# EAGLE board scooter (EAGLE 4.11), part 1 of 2
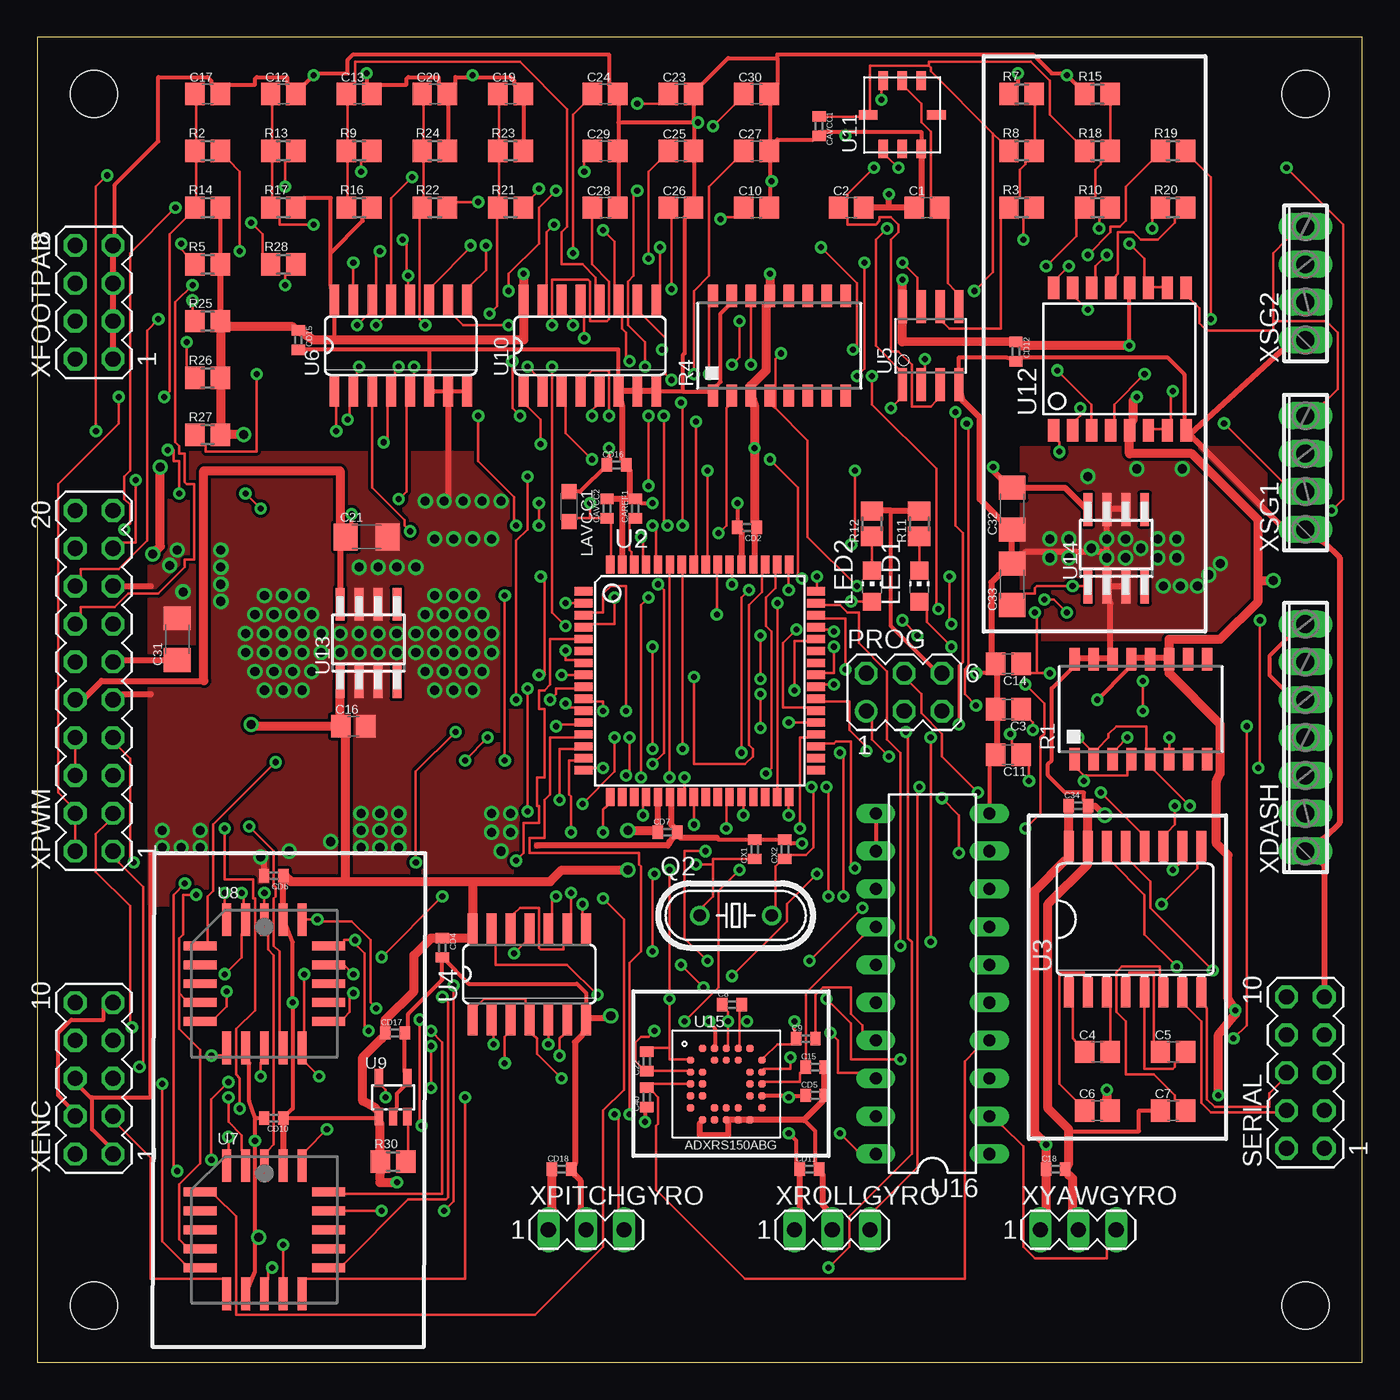
[diagram p5: board, top side]
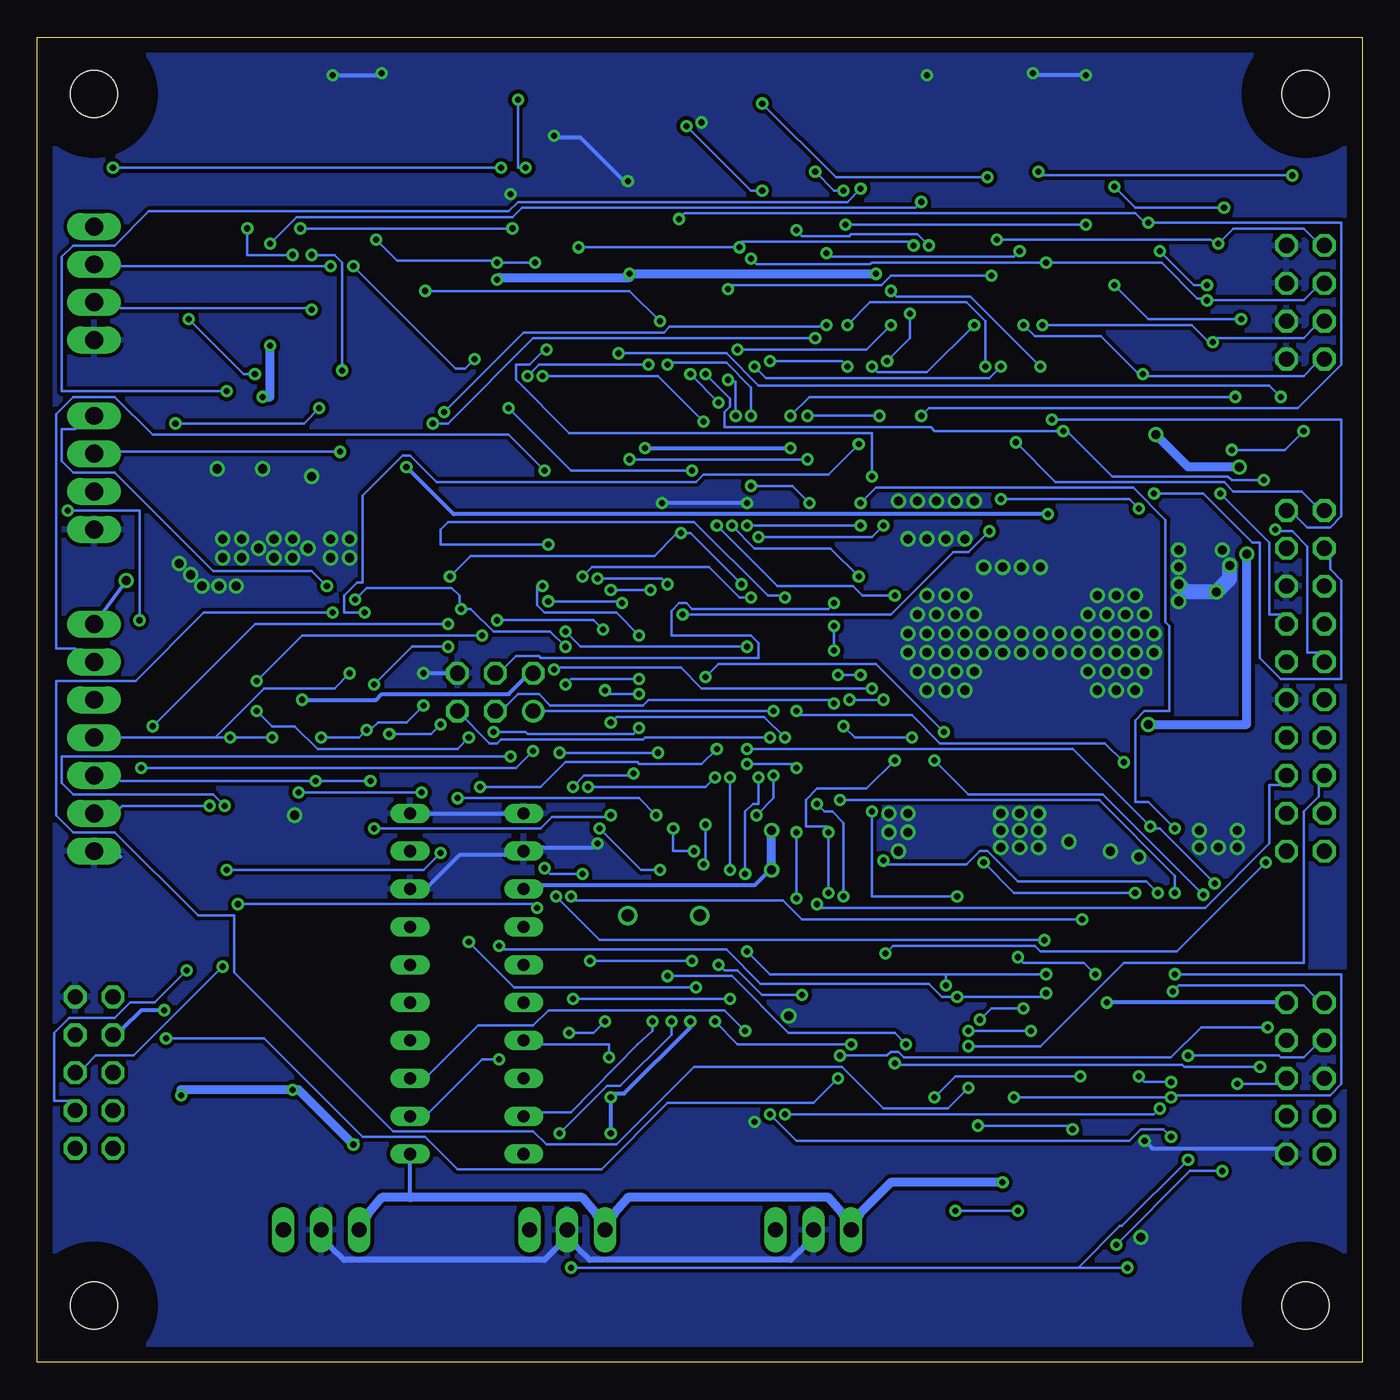
[diagram p6: board, bottom side, seen from below]

Size 88.9 x 88.9 mm. Coordinates in mm from the lower left corner, seen from the top.
Outline: 0,0 88.9,0 88.9,88.9 0,88.9 0,0
Copper layers (1*16): Top 0.035mm / dielectric 1.5mm / Bottom 0.035mm
Design rules "default": minimum track width 7mil, minimum drill 16mil, track to track 8mil, track to pad 8mil, pad to pad 8mil, via to via 8mil, smd to smd 8mil, copper to edge 40mil, drill to drill 8mil, minimum pad ring 10mil, minimum via ring 8mil, stop-mask expansion 4mil, vias tented up to drill 0mil, thermal gap 10mil
Net classes: 1 pwr: width 0.254 mm; 2 bigpwr: width 0.914 mm, clearance 0.813 mm; 3 ugpwr: width 0.61 mm, clearance 0.61 mm
Holes 3.17 mm at 3.81,85.09 85.09,3.81 3.81,3.81 85.09,85.09
tRestrict: area 0,81.3 to 7.6,88.9; area 81.3,81.3 to 88.9,88.9; area 81.3,0 to 88.9,7.6; area 0,0 to 7.6,7.6
bRestrict: area 0,81.3 to 7.6,88.9; area 81.3,81.3 to 88.9,88.9; area 81.3,0 to 88.9,7.6; area 0,0 to 7.6,7.6

## Footprints (pad centres in the part's own frame; a part is rotated, then mirrored left to right if it is on the bottom)
C0805 = smd 1.3 x 1.5: 1 -0.85,0; 2 0.85,0
C0402 = smd 0.7 x 0.9: 1 -0.65,0; 2 0.65,0
C1206 = smd 1.6 x 1.8: 1 -1.4,0; 2 1.4,0
L2012C = smd 1 x 1: 1 -1,0; 2 1,0
CHIP-LED0805 = smd 1.2 x 1.2: A 0,-1.05; C 0,1.05
MA03-2 = drill 1.016 round: 1 -2.54,-1.27 | drill 1.016 octagon: 2 -2.54,1.27; 3 0,-1.27; 4 0,1.27; 5 2.54,-1.27; 6 2.54,1.27
HC49/S = drill 0.813 round: 1 -2.413,0; 2 2.413,0
4816P = smd 0.7 x 1.5: 1 -4.445,-3.346; 2 -3.175,-3.346; 3 -1.905,-3.346; 4 -0.635,-3.346; 5 0.635,-3.346; 6 1.905,-3.346; 7 3.175,-3.346; 8 4.445,-3.346; 9 4.445,3.346; 10 3.175,3.346; 11 1.905,3.346; 12 0.635,3.346; 13 -0.635,3.346; 14 -1.905,3.346; 15 -3.175,3.346; 16 -4.445,3.346
R0805 = smd 1.3 x 1.5: 1 -0.85,0; 2 0.85,0
MA05-2 = drill 1.016 octagon: 1 -5.08,-1.27; 2 -5.08,1.27; 3 -2.54,-1.27; 4 -2.54,1.27; 5 0,-1.27; 6 0,1.27; 7 2.54,-1.27; 8 2.54,1.27; 9 5.08,-1.27; 10 5.08,1.27
TQFP64 = smd 1.194 x 0.559: 1 -7.8,6; 2 -7.8,5.2; 3 -7.8,4.4; 4 -7.8,3.6; 5 -7.8,2.8; 6 -7.8,2; 7 -7.8,1.2; 8 -7.8,0.4; 9 -7.8,-0.4; 10 -7.8,-1.2; 11 -7.8,-2; 12 -7.8,-2.8; 13 -7.8,-3.6; 14 -7.8,-4.4; 15 -7.8,-5.2; 16 -7.8,-6; 33 7.8,-6; 34 7.8,-5.2; 35 7.8,-4.4; 36 7.8,-3.6; 37 7.8,-2.8; 38 7.8,-2; 39 7.8,-1.2; 40 7.8,-0.4; 41 7.8,0.4; 42 7.8,1.2; 43 7.8,2; 44 7.8,2.8; 45 7.8,3.6; 46 7.8,4.4; 47 7.8,5.2; 48 7.8,6 | smd 0.559 x 1.194: 17 -6,-7.8; 18 -5.2,-7.8; 19 -4.4,-7.8; 20 -3.6,-7.8; 21 -2.8,-7.8; 22 -2,-7.8; 23 -1.2,-7.8; 24 -0.4,-7.8; 25 0.4,-7.8; 26 1.2,-7.8; 27 2,-7.8; 28 2.8,-7.8; 29 3.6,-7.8; 30 4.4,-7.8; 31 5.2,-7.8; 32 6,-7.8; 49 6,7.8; 50 5.2,7.8; 51 4.4,7.8; 52 3.6,7.8; 53 2.8,7.8; 54 2,7.8; 55 1.2,7.8; 56 0.4,7.8; 57 -0.4,7.8; 58 -1.2,7.8; 59 -2,7.8; 60 -2.8,7.8; 61 -3.6,7.8; 62 -4.4,7.8; 63 -5.2,7.8; 64 -6,7.8
SO16L = smd 0.66 x 2.032: 1 -4.445,-4.902; 2 -3.175,-4.902; 3 -1.905,-4.902; 4 -0.635,-4.902; 5 0.635,-4.902; 6 1.905,-4.902; 7 3.175,-4.902; 8 4.445,-4.902; 9 4.445,4.902; 10 3.175,4.902; 11 1.905,4.902; 12 0.635,4.902; 13 -0.635,4.902; 14 -1.905,4.902; 15 -3.175,4.902; 16 -4.445,4.902
SO14 = smd 0.66 x 2.032: 1 -3.81,-3.073; 2 -2.54,-3.073; 3 -1.27,-3.073; 4 0,-3.073; 5 1.27,-3.073; 6 2.54,-3.073; 7 3.81,-3.073; 8 3.81,3.073; 9 2.54,3.073; 10 1.27,3.073; 11 0,3.073; 12 -1.27,3.073; 13 -2.54,3.073; 14 -3.81,3.073
SO08 = smd 0.61 x 2.21: 1 -1.905,-2.616; 2 -0.635,-2.616; 3 0.635,-2.616; 4 1.905,-2.616; 5 1.905,2.616; 6 0.635,2.616; 7 -0.635,2.616; 8 -1.905,2.616
SO16 = smd 0.66 x 2.032: 1 -4.445,-3.073; 2 -3.175,-3.073; 3 -1.905,-3.073; 4 -0.635,-3.073; 5 0.635,-3.073; 6 1.905,-3.073; 7 3.175,-3.073; 8 4.445,-3.073; 9 4.445,3.073; 10 3.175,3.073; 11 1.905,3.073; 12 0.635,3.073; 13 -0.635,3.073; 14 -1.905,3.073; 15 -3.175,3.073; 16 -4.445,3.073
PLCC20 = smd 0.6 x 2.2: 1 0,4.3; 2 -1.27,4.3; 3 -2.54,4.3; 9 -2.54,-4.3; 10 -1.27,-4.3; 11 0,-4.3; 12 1.27,-4.3; 13 2.54,-4.3; 19 2.54,4.3; 20 1.27,4.3 | smd 2.2 x 0.6: 4 -4.3,2.54; 5 -4.3,1.27; 6 -4.3,0; 7 -4.3,-1.27; 8 -4.3,-2.54; 14 4.3,-2.54; 15 4.3,-1.27; 16 4.3,0; 17 4.3,1.27; 18 4.3,2.54
SOT23-5L = smd 0.55 x 1.2: 1 -0.95,-1.3; 2 0,-1.3; 3 0.95,-1.3; 4 0.95,1.3; 5 -0.95,1.3
E-8 = smd 1.27 x 0.635: 1 -2.286,1.27; 2 -2.286,0; 3 -2.286,-1.27; 5 2.286,-1.27; 6 2.286,0; 7 2.286,1.27 | smd 0.635 x 1.27: 4 0,-2.286; 8 0,2.286
SO16-1 = smd 0.762 x 1.524: 1 -4.445,-4.775; 2 -3.175,-4.775; 3 -1.905,-4.775; 4 -0.635,-4.775; 5 0.635,-4.775; 6 1.905,-4.775; 7 3.175,-4.775; 8 4.445,-4.775; 9 4.445,4.775; 10 3.175,4.775; 11 1.905,4.775; 12 0.635,4.775; 13 -0.635,4.775; 14 -1.905,4.775; 15 -3.175,4.775; 16 -4.445,4.775
SO08' = smd 0.6 x 2.2: 1 -1.905,-2.6; 2 -0.635,-2.6; 3 0.635,-2.6; 4 1.905,-2.6; 5 1.905,2.6; 6 0.635,2.6; 7 -0.635,2.6; 8 -1.905,2.6
BC-32 = smd 0.5 x 0.5: A2 -1.6,2.4; A3 -0.8,2.4; A4 0,2.4; A5 0.8,2.4; A6 1.6,2.4; B1 -2.4,1.6; B3 -0.8,1.6; B4 0,1.6; B5 0.8,1.6; B7 2.4,1.6; C1 -2.4,0.8; C2 -1.6,0.8; C6 1.6,0.8; C7 2.4,0.8; D1 -2.4,0; D2 -1.6,0; D6 1.6,0; D7 2.4,0; E1 -2.4,-0.8; E2 -1.6,-0.8; E6 1.6,-0.8; E7 2.4,-0.8; F1 -2.4,-1.6; F3 -0.8,-1.6; F4 0,-1.6; F5 0.8,-1.6; F7 2.4,-1.6; G2 -1.6,-2.4; G3 -0.8,-2.4; G4 0,-2.4; G5 0.8,-2.4; G6 1.6,-2.4
DIL20 = drill 0.813 long: 1 -11.43,-3.81; 2 -8.89,-3.81; 3 -6.35,-3.81; 4 -3.81,-3.81; 5 -1.27,-3.81; 6 1.27,-3.81; 7 3.81,-3.81; 8 6.35,-3.81; 9 8.89,-3.81; 10 11.43,-3.81; 11 11.43,3.81; 12 8.89,3.81; 13 6.35,3.81; 14 3.81,3.81; 15 1.27,3.81; 16 -1.27,3.81; 17 -3.81,3.81; 18 -6.35,3.81; 19 -8.89,3.81; 20 -11.43,3.81
7POL254 = drill 1.2 long: 1 -7.62,0; 2 -5.08,0; 3 -2.54,0; 4 0,0; 5 2.54,0; 6 5.08,0; 7 7.62,0
MA04-2 = drill 1.016 octagon: 1 -3.81,-1.27; 2 -3.81,1.27; 3 -1.27,-1.27; 4 -1.27,1.27; 5 1.27,-1.27; 6 1.27,1.27; 7 3.81,-1.27; 8 3.81,1.27
MA03-1 = drill 1.016 long: 1 -2.54,0; 2 0,0; 3 2.54,0
MA10-2 = drill 1.016 octagon: 1 -11.43,-1.27; 2 -11.43,1.27; 3 -8.89,-1.27; 4 -8.89,1.27; 5 -6.35,-1.27; 6 -6.35,1.27; 7 -3.81,-1.27; 8 -3.81,1.27; 9 -1.27,-1.27; 10 -1.27,1.27; 11 1.27,-1.27; 12 1.27,1.27; 13 3.81,-1.27; 14 3.81,1.27; 15 6.35,-1.27; 16 6.35,1.27; 17 8.89,-1.27; 18 8.89,1.27; 19 11.43,-1.27; 20 11.43,1.27
4POL254 = drill 1.2 long: 1 -3.81,0; 2 -1.27,0; 3 1.27,0; 4 3.81,0

## Placement (x,y rotation side)
C1  0.22uF  [C0805]  59.69,77.47 0 top
C2  0.22uF  [C0805]  54.61,77.47 0 top
C3  0.1uF  [C0805]  65.15,43.81 180 top
C4  1.0uF  [C0805]  71.12,20.83 0 top
C5  1.0uF  [C0805]  76.2,20.83 0 top
C6  1.0uF  [C0805]  71.12,16.89 0 top
C7  1.0uF  [C0805]  76.2,16.89 0 top
C8  22nF  [C0402]  46.61,24 0 top
C9  22nF  [C0402]  51.56,21.72 0 top
C10  0.1uF  [C0805]  48.26,77.47 0 top
C11  0.1uF  [C0805]  65.15,40.77 180 top
C12  0.1uF  [C0805]  16.51,85.09 0 top
C13  0.1uF  [C0805]  21.59,85.09 0 top
C14  0.1uF  [C0805]  65.15,46.86 180 top
C15  47nF  [C0402]  52.2,19.81 0 top
C16  10uF 6v  [C0805]  21.21,42.67 0 top
C17  0.1uF  [C0805]  11.43,85.09 0 top
C18  1uF 6v  [C0402]  68.33,12.95 0 top
C19  1.0uF  [C0805]  31.75,85.09 0 top
C20  1.0uF  [C0805]  26.67,85.09 0 top
C21  10uF 25v  [C1206]  22.1,55.37 0 top
C22  10nF  [C0402]  40.89,20.19 90 top
C23  0.1uF  [C0805]  43.18,85.09 0 top
C24  0.1uF  [C0805]  38.1,85.09 0 top
C25  0.1uF  [C0805]  43.18,81.28 0 top
C26  0.1uF  [C0805]  43.18,77.47 0 top
C27  0.1uF  [C0805]  48.26,81.28 0 top
C28  0.1uF  [C0805]  38.1,77.47 0 top
C29  0.1uF  [C0805]  38.1,81.28 0 top
C30  0.1uF  [C0805]  48.26,85.09 0 top
C31  10uF 25v  [C1206]  9.4,48.51 90 top
C32  10uF 25v  [C1206]  65.41,57.28 90 top
C33  10uF 25v  [C1206]  65.41,52.2 90 top
C34  1uF 6v  [C0402]  69.85,37.34 0 top
C40  1uF 6v  [C0402]  40.89,17.78 90 top
CAREF1  1uF 6v  [C0402]  40.13,57.28 90 top
CAVCC1  1uF 6v  [C0402]  52.45,82.93 270 top
CAVCC2  1uF 6v  [C0402]  38.23,57.28 90 top
CD2  1uF 6v  [C0402]  47.62,56.01 180 top
CD4  1uF 6v  [C0402]  27.18,27.81 270 top
CD5  1uF 6v  [C0402]  52.2,17.91 0 top
CD6  1uF 6v  [C0402]  15.88,32.64 180 top
CD7  1uF 6v  [C0402]  42.29,35.56 0 top
CD10  1uF 6v  [C0402]  15.88,16.38 180 top
CD11  1uF 6v  [C0402]  51.82,12.95 0 top
CD12  1uF 6v  [C0402]  65.66,67.82 270 top
CD15  1uF 6v  [C0402]  17.53,68.58 270 top
CD16  1uF 6v  [C0402]  38.86,60.2 0 top
CD17  1uF 6v  [C0402]  24,22.1 0 top
CD18  1uF 6v  [C0402]  35.18,12.95 0 top
CX1  18pF  [C0402]  48.13,34.42 90 top
CX2  18pF  [C0402]  50.16,34.42 90 top
LAVCC1  10uH  [L2012C]  35.69,57.4 270 top
LED1  [CHIP-LED0805]  59.18,52.07 0 top
LED2  [CHIP-LED0805]  56.01,52.07 0 top
PROG  [MA03-2]  58.17,44.96 0 top
Q2  14.7  [HC49/S]  46.86,29.97 0 top
R1  10k  [4816P]  74.04,43.81 0 top
R2  10k 0.1%  [R0805]  11.43,81.28 0 top
R3  10k 0.1%  [R0805]  66.04,77.47 0 top
R4  10k  [4816P]  49.78,68.2 0 top
R5  4.7k  [R0805]  11.43,73.66 0 top
R7  10k 0.1%  [R0805]  66.04,85.09 0 top
R8  10k 0.1%  [R0805]  66.04,81.28 0 top
R9  10k 0.1%  [R0805]  21.59,81.28 0 top
R10  10k 0.1%  [R0805]  71.12,77.47 0 top
R11  240  [R0805]  59.18,56.26 90 top
R12  240  [R0805]  56.01,56.26 90 top
R13  10k 0.1%  [R0805]  16.51,81.28 0 top
R14  10k 0.1%  [R0805]  11.43,77.47 0 top
R15  10k 0.1%  [R0805]  71.12,85.09 0 top
R16  10k 0.1%  [R0805]  21.59,77.47 0 top
R17  10k 0.1%  [R0805]  16.51,77.47 0 top
R18  10k 0.1%  [R0805]  71.12,81.28 0 top
R19  400  [R0805]  76.2,81.28 0 top
R20  400  [R0805]  76.2,77.47 0 top
R21  10k 0.1%  [R0805]  31.75,77.47 0 top
R22  10k 0.1%  [R0805]  26.67,77.47 0 top
R23  10k 0.1%  [R0805]  31.75,81.28 0 top
R24  10k 0.1%  [R0805]  26.67,81.28 0 top
R25  4.7k  [R0805]  11.43,69.85 0 top
R26  4.7k  [R0805]  11.43,66.04 0 top
R27  4.7k  [R0805]  11.43,62.23 0 top
R28  4.7k  [R0805]  16.51,73.66 0 top
R30  10k 0.1%  [R0805]  23.88,13.46 0 top
SERIAL  [MA05-2]  85.09,19.43 90 top
U2  MEGA128-A  [TQFP64]  44.45,45.72 0 top
U3  MAX232ECWE  [SO16L]  73.66,29.72 0 top
U4  74HC08D  [SO14]  33.02,26.04 0 top
U5  OPA2340U  [SO08]  59.94,68.2 0 top
U6  74HC4051D  [SO16]  24.38,68.2 0 top
U7  HCTL-2016#PLC  [PLCC20]  15.24,8.89 0 top
U8  HCTL-2016#PLC  [PLCC20]  15.24,25.4 0 top
U9  LTC1799S5  [SOT23-5L]  23.88,17.78 0 top
U10  74HC4051D  [SO16]  37.08,68.2 0 top
U11  ADXL311JE  [E-8]  58.04,83.69 90 top
U12  INA2128U  [SO16-1]  72.64,67.31 0 top
U13  TL750L05C  [SO08']  22.23,48.26 0 top
U14  TL750L010C  [SO08']  72.39,54.61 0 top
U15  ADXRS150ABG  [BC-32]  46.23,18.67 0 top
U16  ADXRS150ABGEB  [DIL20]  60.07,25.4 90 top
XDASH  [7POL254]  85.09,41.91 90 top
XENC  [MA05-2]  3.81,19.05 90 top
XFOOTPAD  [MA04-2]  3.81,71.12 90 top
XPITCHGYRO  [MA03-1]  36.83,8.89 0 top
XPWM  [MA10-2]  3.81,45.72 90 top
XROLLGYRO  [MA03-1]  53.34,8.89 0 top
XSG1  [4POL254]  85.09,59.69 90 top
XSG2  [4POL254]  85.09,72.39 90 top
XYAWGYRO  [MA03-1]  69.85,8.89 0 top